# EAGLE design PS2 Adapter (EAGLE 5.10)
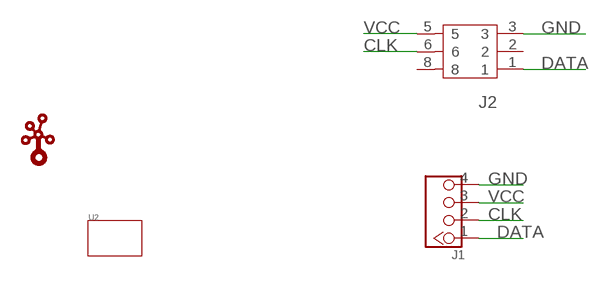
[diagram p0: schematic, sheet 1]

## Parts
J1  TWIG-2.0-LEADED-2.0  [4P-LEADED-2.0]
J2  HOLDER-PS/2'-90D'  [6P-14.0X12.4-90D]
U2  TWIG-1U  [1U-DIM-W/-DRILL]
U$1  LOGO-TWIGTWIGLOGO_SMALL  [TWIGLOGO_SMALL]

## Nets
CLK: J1.2 J2.6
DATA: J1.1 J2.1
GND: J1.4 J2.3
VCC: J1.3 J2.5
Unconnected: J2.2 J2.8

## Library data of the parts
J1 = Connector:TWIG-2.0-LEADED
J2 = Connector:HOLDER-PS/2: MINI DIN FEMALE
U2 = Module:TWIG
U$1 = Logo:LOGO-TWIG

## Board
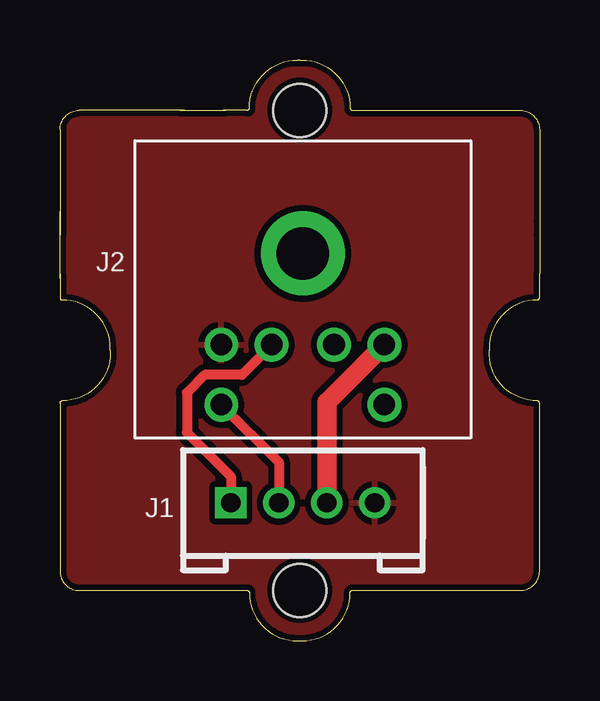
[diagram p1: board, top side]
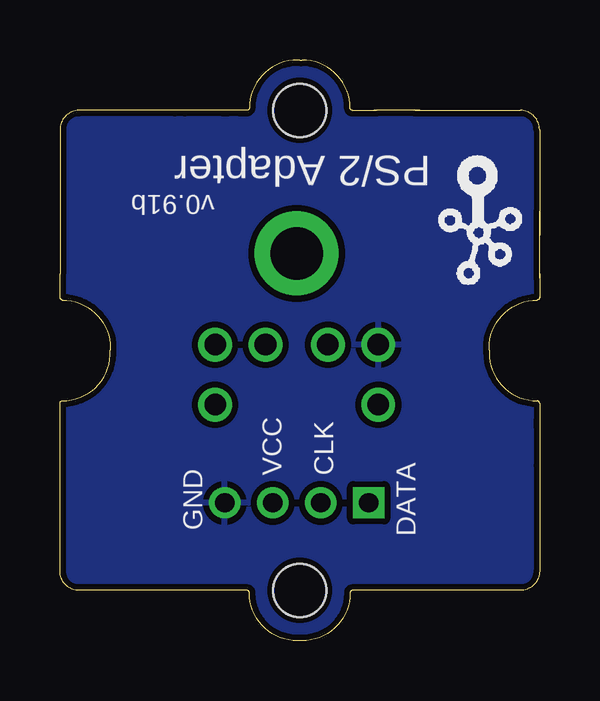
[diagram p2: board, bottom side, seen from below]

Size 20 x 24.2 mm. Coordinates in mm from the lower left corner, seen from the top.
Copper layers (1*16): Top 0.035mm / dielectric 1.5mm / Bottom 0.035mm
Design rules "SeeedStudio_rule_no_angle_090911 *": minimum track width 6mil, minimum drill 12mil, track to track 6mil, track to pad 6mil, pad to pad 6mil, via to via 6mil, smd to smd 0mil, copper to edge 10mil, drill to drill 10mil, minimum pad ring 10mil, minimum via ring 6mil, stop-mask expansion 2mil, vias tented up to drill 25mil, thermal gap 10mil

### Footprints (pad centres in the part's own frame; a part is rotated, then mirrored left to right if it is on the bottom)
4P-LEADED-2.0 = drill 0.8 pad 1.27 square: 1 -3,0 | drill 0.8 pad 1.27 round: 2 -1,0; 3 1,0; 4 3,0
6P-14.0X12.4-90D = drill 0.9 pad 1.4 round: 1 -1.3,-2.3; 2 1.3,-2.3; 3 -3.4,-2.3; 5 3.4,-2.3; 6 -3.4,-4.8; 8 3.4,-4.8 | drill 2.2 pad 3.5 round: P$1 0,1.5
1U-DIM-W/-DRILL = hole 2.2: 0,-10; 0,10

### Placement (x,y rotation side)
J1  10.13,5.75 0 top
J2  10.13,14.64 0 top
U2  10,12.1 180 bottom
U$1  0.35,20.35 180 bottom

### Tracks (layer width: path | path; a pad name or v marks a point on that pad's centre or on a via)
CLK
  Top 0.406: J1.2 9.13,7.44 J2.6
DATA
  Top 0.406: J2.1 8.83,12.32 7.59,11.08 6.04,11.08 5.3,10.34 5.3,8.67 7.13,6.84 J1.1
GND
  pour Bottom (isolate 0.254): 20.16,0.03 -0.16,0.03 -0.16,24.16 20.16,24.16
  pour Top (isolate 0.254): 20.16,0.03 -0.16,0.03 -0.16,24.16 20.16,24.16
VCC
  Top 0.813: J1.3 11.13,9.94 J2.5

### Text on the board
bPlace: PS/2 Adapter | v0.91b | CLK | VCC | DATA | GND